# Altium schematic sheet SRAM0 - IS61WV12816DBLL-10BLI.SchDoc
size A4
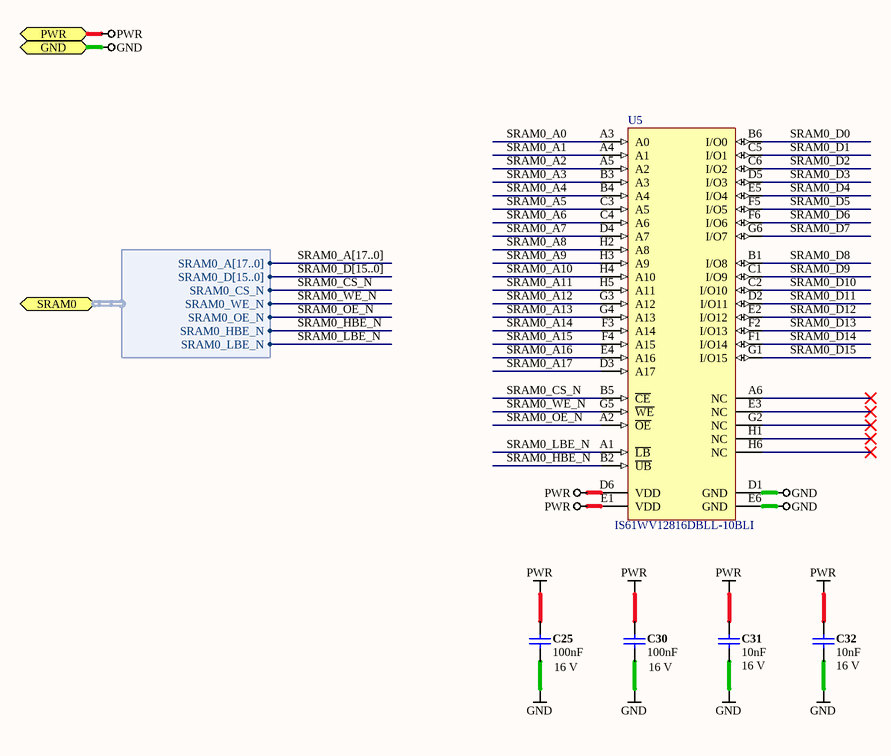
[diagram p0: SRAM0 - IS61WV12816DBLL-10BLI.SchDoc]

## Parts
C25  value 100nF  Rated Voltage: 16 V  [CAPC0402(1005)60_L]  (hidden comment: CAP 100nF 16V 0402(1005))
C30  value 100nF  Rated Voltage: 16 V  [CAPC0402(1005)60_L]  (hidden comment: CAP 100nF 16V 0402(1005))
C31  value 10nF  Rated Voltage: 16 V  [CAPC0402(1005)33_L]  (hidden comment: CAP 10nF 16V 0402(1005))
C32  value 10nF  Rated Voltage: 16 V  [CAPC0402(1005)33_L]  (hidden comment: CAP 10nF 16V 0402(1005))
U5  IS61WV12816DBLL-10BLI  [ISSI-TF-BGA-48-6000X8000DE]

## Ports
GND, PWR, SRAM0 (harness SRAM0)

## Harnesses
SRAM0: SRAM0_A[17..0], SRAM0_D[15..0], SRAM0_CS_N, SRAM0_WE_N, SRAM0_OE_N, SRAM0_HBE_N, SRAM0_LBE_N

## Nets
GND: C25.2 C30.2 C31.2 C32.2 U5.D1(GND) U5.E6(GND) ; port GND
PWR: C25.1 C30.1 C31.1 C32.1 U5.D6(VDD) U5.E1(VDD) ; port PWR
SRAM0_A0: U5.A3(A0)
SRAM0_A1: U5.A4(A1)
SRAM0_A2: U5.A5(A2)
SRAM0_A3: U5.B3(A3)
SRAM0_A4: U5.B4(A4)
SRAM0_A5: U5.C3(A5)
SRAM0_A6: U5.C4(A6)
SRAM0_A7: U5.D4(A7)
SRAM0_A8: U5.H2(A8)
SRAM0_A9: U5.H3(A9)
SRAM0_A10: U5.H4(A10)
SRAM0_A11: U5.H5(A11)
SRAM0_A12: U5.G3(A12)
SRAM0_A13: U5.G4(A13)
SRAM0_A14: U5.F3(A14)
SRAM0_A15: U5.F4(A15)
SRAM0_A16: U5.E4(A16)
SRAM0_A17: U5.D3(A17)
SRAM0_CS_N: U5.B5(~{CE}) ; port SRAM0.SRAM0_CS_N
SRAM0_D0: U5.B6(I/O0)
SRAM0_D1: U5.C5(I/O1)
SRAM0_D2: U5.C6(I/O2)
SRAM0_D3: U5.D5(I/O3)
SRAM0_D4: U5.E5(I/O4)
SRAM0_D5: U5.F5(I/O5)
SRAM0_D6: U5.F6(I/O6)
SRAM0_D7: U5.G6(I/O7)
SRAM0_D8: U5.B1(I/O8)
SRAM0_D9: U5.C1(I/O9)
SRAM0_D10: U5.C2(I/O10)
SRAM0_D11: U5.D2(I/O11)
SRAM0_D12: U5.E2(I/O12)
SRAM0_D13: U5.F2(I/O13)
SRAM0_D14: U5.F1(I/O14)
SRAM0_D15: U5.G1(I/O15)
SRAM0_HBE_N: U5.B2(~{UB}) ; port SRAM0.SRAM0_HBE_N
SRAM0_LBE_N: U5.A1(~{LB}) ; port SRAM0.SRAM0_LBE_N
SRAM0_OE_N: U5.A2(~{OE}) ; port SRAM0.SRAM0_OE_N
SRAM0_WE_N: U5.G5(~{WE}) ; port SRAM0.SRAM0_WE_N

Not connected (* = marked no-connect by the designer): U5 A6(NC)* E3(NC)* G2(NC)* H1(NC)* H6(NC)*

## Buses and harness runs
bus SRAM0_A[17..0]
bus SRAM0_D[15..0]

## Library data of the parts
C25 C30 = CAP 100nF 16V ±10% 0402 (1005 Metric) Thickness 0.6mm SMD: Case-EIA: 0402; Case-Metric: 1005; Tolerance: ±10%; Max Thickness: 0.6 mm; Technology: SMT
C31 C32 = CMP-1034-01875-1: CAP 10nF 16V ±10% 0402 (1005 Metric) Thickness 0.33mm SMD; Case-EIA: 0402; Case-Metric: 1005; Max Thickness: 0.33 mm; Tolerance: ±10%; Technology: SMT
U5 = CMP-0513-00111-1: 2 M High Speed Asynchronous CMOS SRAM, 128 K x 16, -40 to 85 degC, 48-Pin BGA (TF-BGA-48), Pb-Free; Manufacturer: Integrated Silicon Solution Inc (ISSI); Speed (ns): 10; Packing: Tray / Tube; Mounting Technology: Surface Mount; DatasheetVersion: Rev. D; PackageReference: TF-BGA-48; ComponentLink2URL: http://www.issi.com/WW/pdf/61-64WV12816DAxx-DBxx.pdf; PartNumber: IS61WV12816DBLL-10BLI; ComponentLink2Description: Datasheet; PackageDescription: 48-Pin 6 x 8 mm TF-BGA, Pitch 0.75 mm; ComponentLink1Description: Manufacturer URL; Code_JEDEC: MO-207; PackageVersion: Rev. C, 08/2008; Organization: 128K x 16; RoHS: Pb-Free; ComponentLink1URL: http://www.issi.com/US/index.shtml; ComponentLink3URL: http://www.issi.com/WW/pdf/61-64WV25616.pdf; ComponentLink3Description: Package Specification